# Altium project PRJ - LV Distribution & SD Latch.PrjPCB
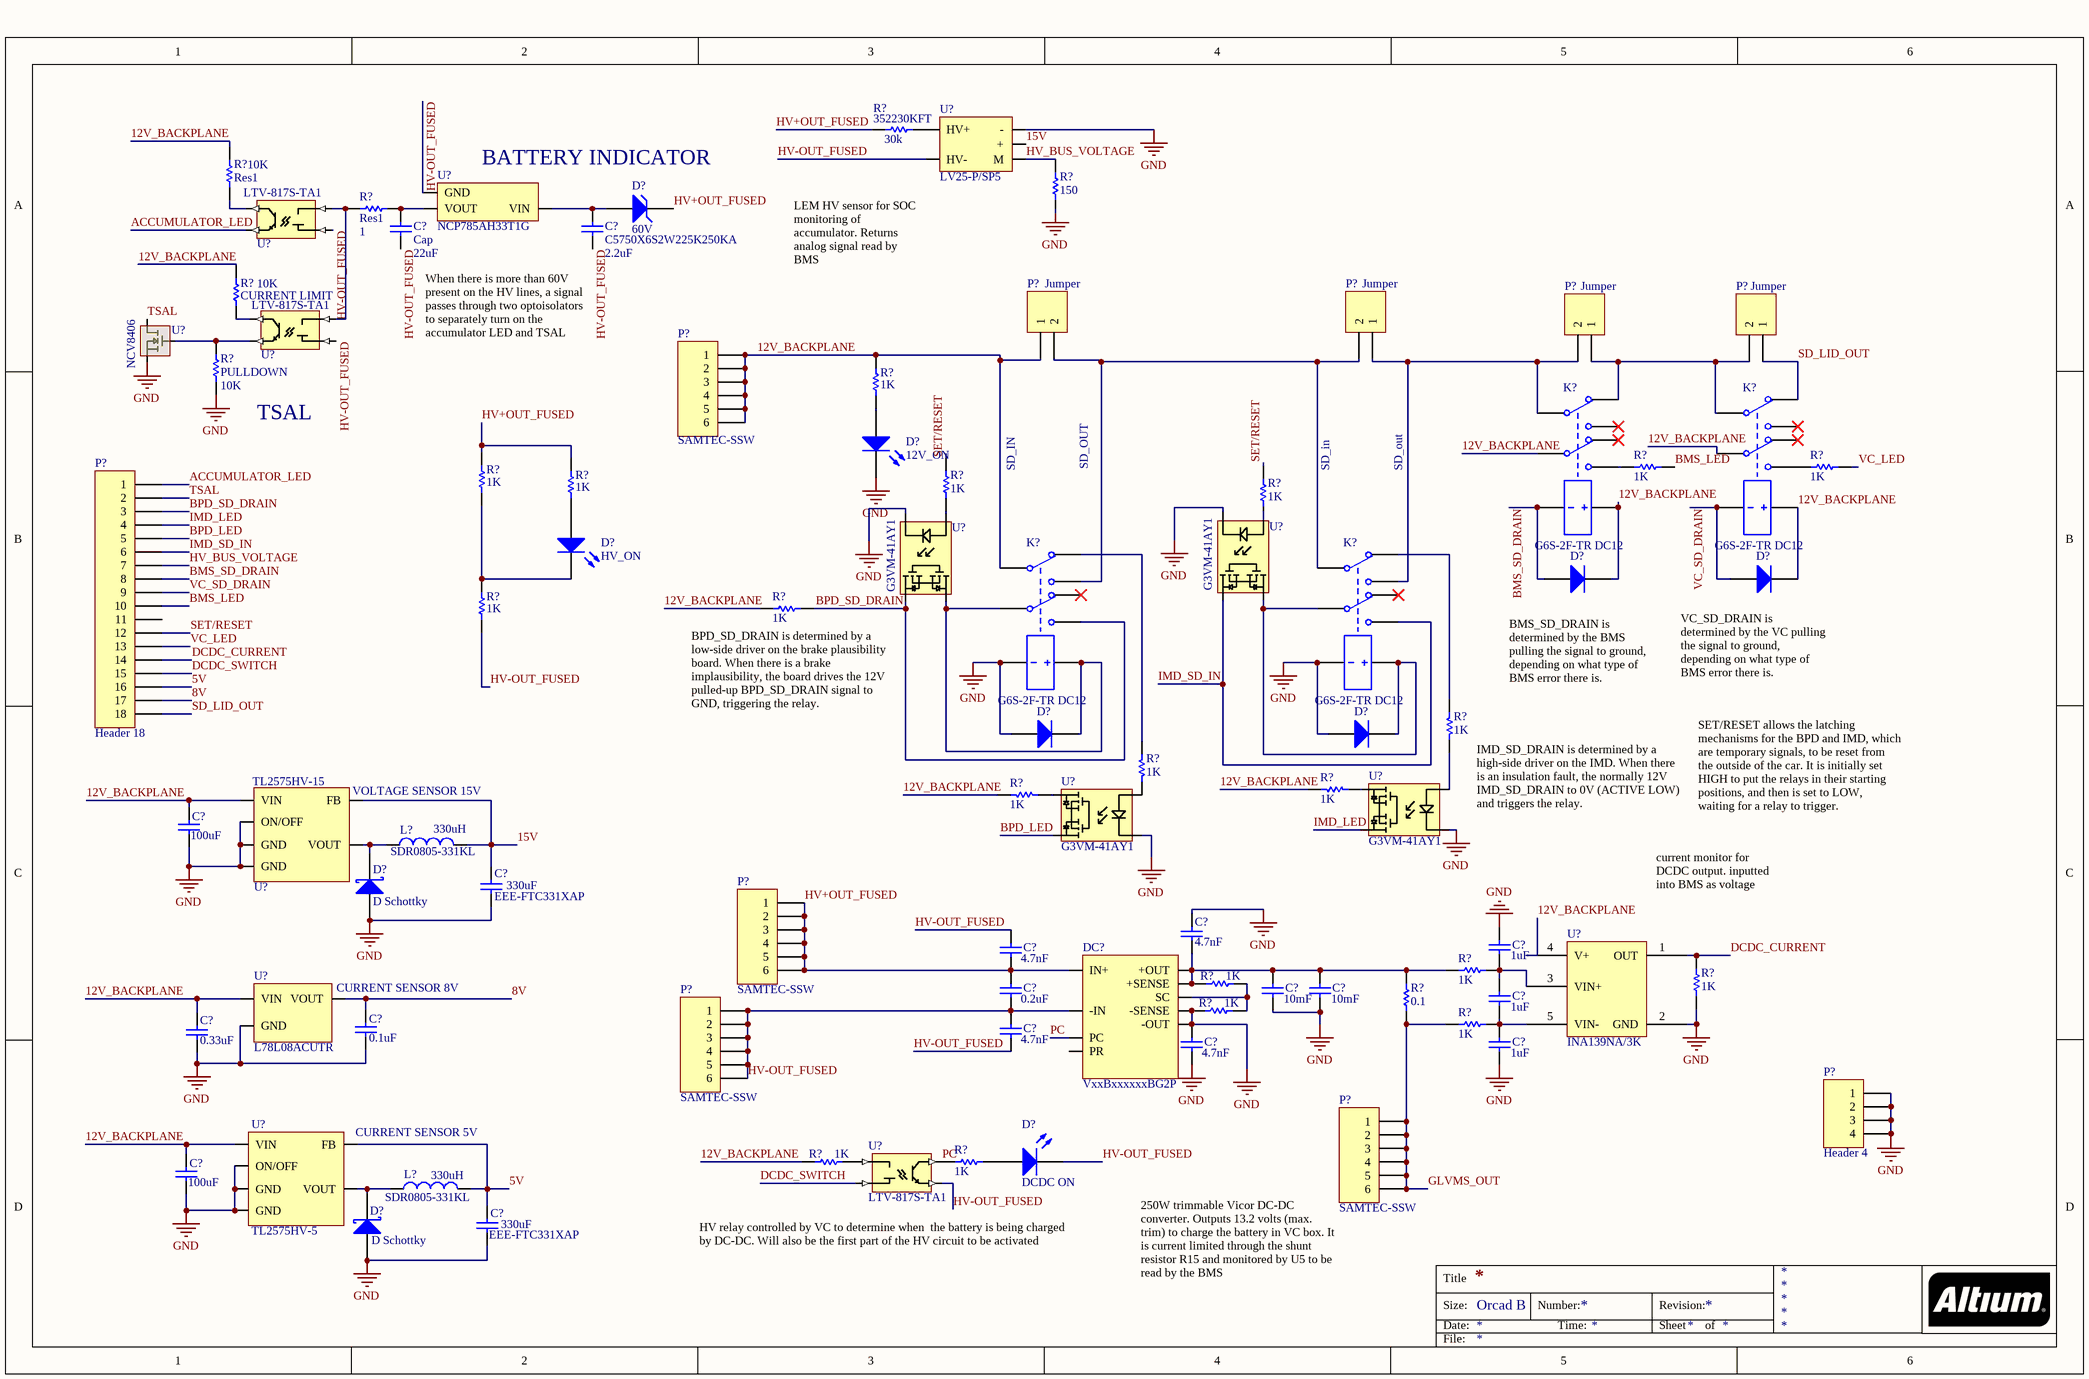
[diagram p0: LV Distribution & SD Latch.SchDoc]
1 sheet, 86 parts. Net scope: global (net labels, ports and power ports of the same name join across sheets).

## Sheet LV Distribution & SD Latch.SchDoc
size OrCAD B

### Parts
(Parts that share a designator on the sheet are numbered #1, #2 ... from top to bottom, then left to right.)
C?#1  Cap  value 22uF  [C0805]
C?#2  C5750X6S2W225K250KA  value 2.2uF  [CAPC5750L]
C?#3  value 100uF  [C1206]  (hidden comment: Cap)
C?#4  EEE-FTC331XAP  value 330uF  [EEE-FTC331XAP]
C?#5  value 4.7nF  [C0805]  (hidden comment: Cap)
C?#6  value 4.7nF  [C1206]  (hidden comment: Cap)
C?#7  value 1uF  [C0805]  (hidden comment: Cap)
C?#8  value 0.2uF  [14-1210]  (hidden comment: Cap)
C?#9  value 10mF  [RB7.6-15]  (hidden comment: Cap)
C?#10  value 10mF  [RB7.6-15]  (hidden comment: Cap)
C?#11  value 1uF  [C0805]  (hidden comment: Cap)
C?#12  value 0.33uF  [C0805]  (hidden comment: Cap)
C?#13  value 0.1uF  [C0805]  (hidden comment: Cap)
C?#14  value 4.7nF  [C1206]  (hidden comment: Cap)
C?#15  value 4.7nF  [C0805]  (hidden comment: Cap)
C?#16  value 1uF  [C0805]  (hidden comment: Cap)
C?#17  value 100uF  [C1206]  (hidden comment: Cap)
C?#18  EEE-FTC331XAP  value 330uF  [EEE-FTC331XAP]
D?#1  60V  [SMB]
D?#2  12V_ON  [3.2X1.6X1.1]
D?#3  HV_ON  [3.2X1.6X1.1]
D?#4  Diode 1N4002  [3.2X1.6X1.1]  (value not drawn)
D?#5  Diode 1N4002  [3.2X1.6X1.1]  (value not drawn)
D?#6  Diode 1N4002  [3.2X1.6X1.1]  (value not drawn)
D?#7  Diode 1N4002  [3.2X1.6X1.1]  (value not drawn)
D?#8  D Schottky  [SMB]
D?#9  DCDC ON  [3.2X1.6X1.1]
D?#10  D Schottky  [SMB]
DC?  VxxBxxxxxxBG2P  [VICOR_MINI]
K?#1  G6S-2F-TR DC12  [G6S-2F-TR DC12]
K?#2  G6S-2F-TR DC12  [G6S-2F-TR DC12]
K?#3  G6S-2F-TR DC12  [G6S-2F-TR DC12]
K?#4  G6S-2F-TR DC12  [G6S-2F-TR DC12]
L?#1  SDR0805-331KL  value 330uH  [SDR0805-331KL]
L?#2  SDR0805-331KL  value 330uH  [SDR0805-331KL]
P?#1  Jumper  [HDR1X2]
P?#2  Jumper  [HDR1X2]
P?#3  Jumper  [HDR1X2]
P?#4  Jumper  [HDR1X2]
P?#5  SAMTEC-SSW  [HDR2X3_CEN]
P?#6  Header 18  [HDR2X9]
P?#7  SAMTEC-SSW  [HDR2X3_CEN]
P?#8  SAMTEC-SSW  [HDR2X3_CEN]
P?#9  Header 4  [HDR2X2]
P?#10  SAMTEC-SSW  [HDR2X3_CEN]
R?#1  352230KFT  value 30k  [C2512]
R?#2  value 150  [RESC3216L]  (hidden comment: Res1)
R?#3  Res1  value 10K  [6-0805_L]
R?#4  Res1  value 1  [6-0805_L]
R?#5  CURRENT LIMIT  value 10K  [6-0805_L]
R?#6  PULLDOWN  value 10K  [6-0805_L]
R?#7  value 1K  [6-0805_N]  (hidden comment: Res1)
R?#8  value 1K  [6-0805_N]  (hidden comment: Res1)
R?#9  value 1K  [6-0805_N]  (hidden comment: Res1)
R?#10  value 1K  [6-0805_N]  (hidden comment: Res1)
R?#11  value 1K  [6-0805_N]  (hidden comment: Res1)
R?#12  value 1K  [6-0805_N]  (hidden comment: Res1)
R?#13  value 1K  [6-0805_N]  (hidden comment: Res1)
R?#14  value 1K  [6-0805_N]  (hidden comment: Res1)
R?#15  value 1K  [6-0805_N]  (hidden comment: Res1)
R?#16  value 1K  [6-0805_N]  (hidden comment: Res1)
R?#17  value 1K  [6-0805_N]  (hidden comment: Res1)
R?#18  value 1K  [6-0805_N]  (hidden comment: Res1)
R?#19  value 1K  [6-0805_N]  (hidden comment: Res1)
R?#20  value 1K  [6-0805_N]  (hidden comment: Res1)
R?#21  value 1K  [6-0805_N]  (hidden comment: Res1)
R?#22  value 1K  [6-0805_N]  (hidden comment: Res1)
R?#23  value 1K  [6-0805_N]  (hidden comment: Res1)
R?#24  value 0.1  [2818]
R?#25  value 1K  [6-0805_N]  (hidden comment: Res1)
R?#26  value 1K  [6-0805_N]  (hidden comment: Res1)
R?#27  value 1K  [6-0805_N]  (hidden comment: Res1)
U?#1  LV25-P/SP5  [LV 25-P/SP5]
U?#2  NCP785AH33T1G  [SOT89L]
U?#3  LTV-817S-TA1  [4-PIN SMD]
U?#4  LTV-817S-TA1  [4-PIN SMD]
U?#5  NCV8406  [SOT223-4M]
U?#6  G3VM-41AY1  [4-PIN SMD]
U?#7  G3VM-41AY1  [4-PIN SMD]
U?#8  G3VM-41AY1  [4-PIN SMD]
U?#9  G3VM-41AY1  [4-PIN SMD]
U?#10  TL2575HV-15  [TO170P1520-6N]
U?#11  INA139NA/3K  [SOT23-5AM]
U?#12  L78L08ACUTR  [SOT89]
U?#13  LTV-817S-TA1  [4-PIN SMD]
U?#14  TL2575HV-5  [TO170P1520-6N]

### Nets
GND: C?#3.1 C?#4.1 C?#5.2 C?#7.2 C?#9.1 C?#10.1 C?#12.1 C?#13.1 C?#15.1 C?#15.2 C?#16.1 C?#17.1 C?#18.1 D?#2.2(K) D?#6.1(A) D?#7.1(A) D?#8.1(A) D?#10.1(A) DC?.5(-OUT) DC?.6(-SENSE) K?#3.12 K?#4.12 P?#9.1 P?#9.2 P?#9.3 P?#9.4 R?#2.2 R?#6.1 R?#22.2 R?#23.1 U?#1.3(-) U?#5.3(SOURCE) U?#6.2 U?#7.2 U?#8.2 U?#9.2 U?#10.3(GND) U?#10.5(ON/OFF) U?#10.6(GND) U?#11.2(GND) U?#12.2(GND) U?#14.3(GND) U?#14.5(ON/OFF) U?#14.6(GND)
5V: C?#18.2 L?#2.2 P?#6.16 U?#14.4(FB)
8V: C?#13.2 P?#6.17 U?#12.1(VOUT)
12V_BACKPLANE: C?#3.2 C?#12.2 C?#17.2 D?#4.2(K) D?#5.2(K) K?#1.1 K?#1.9 K?#2.1 K?#2.9 K?#3.4 P?#1.1 P?#5.1 P?#5.2 P?#5.3 P?#5.4 P?#5.5 P?#5.6 R?#3.2 R?#5.2 R?#7.2 R?#14.1 R?#18.2 R?#19.2 R?#26.1 U?#10.1(VIN) U?#11.4(V+) U?#12.3(VIN) U?#14.1(VIN)
15V: C?#4.2 L?#1.2 U?#1.4(+) U?#10.4(FB)
ACCUMULATOR_LED: P?#6.1 U?#3.3
BMS_LED: P?#6.10 R?#8.2
BMS_SD_DRAIN: D?#4.1(A) K?#1.12 P?#6.8
BPD_LED: P?#6.5 U?#9.3
BPD_SD_DRAIN: K?#3.8 P?#6.3 R?#14.2 U?#6.3
DCDC_CURRENT: P?#6.14 R?#22.1 U?#11.1(OUT)
DCDC_SWITCH: P?#6.15 U?#13.2(OPTO1_OUT)
GLVMS_OUT: P?#10.1 P?#10.2 P?#10.3 P?#10.4 P?#10.5 P?#10.6 R?#24.1 R?#25.1
HV+OUT_FUSED: C?#6.1 C?#8.2 D?#1.2(K) DC?.1(IN+) P?#7.1 P?#7.2 P?#7.3 P?#7.4 P?#7.5 P?#7.6 R?#1.1 R?#12.2 R?#13.2
HV-OUT_FUSED: C?#1.1 C?#2.1 C?#6.2 C?#8.1 C?#14.1 C?#14.2 D?#9.2(K) DC?.4(-IN) P?#8.1 P?#8.2 P?#8.3 P?#8.4 P?#8.5 P?#8.6 R?#15.1 U?#1.2(HV-) U?#2.2(GND) U?#3.2(OPTO1_OUT) U?#4.2(OPTO1_OUT) U?#13.3
HV_BUS_VOLTAGE: P?#6.7 R?#2.1 U?#1.5(M)
IMD_LED: P?#6.4 U?#8.3
IMD_SD_IN: K?#4.8 P?#6.6 U?#7.3
PC: DC?.2(PC) R?#27.1 U?#13.4(OPTO1_C)
SD_LID_OUT: K?#2.3 P?#4.1 P?#6.18
SET/RESET: P?#6.12 R?#9.1 R?#10.1
TSAL: P?#6.2 U?#5.4(DRAIN)
VC_LED: P?#6.13 R?#11.1
VC_SD_DRAIN: D?#5.1(A) K?#2.12 P?#6.9
NetC?#1_2: C?#1.2 R?#4.2 U?#2.3(VOUT)
NetC?#2_2: C?#2.2 D?#1.1(A) U?#2.1(VIN)
NetC?#5_1: C?#5.1 C?#9.2 C?#10.2 DC?.8(+SENSE) DC?.9(+OUT) R?#20.1 R?#21.1 R?#24.2
NetC?#7_1: C?#7.1 C?#11.2 R?#20.2 U?#11.3(VIN+)
NetC?#11_1: C?#11.1 C?#16.2 R?#25.2 U?#11.5(VIN-)
NetD?#2_1: D?#2.1(A) R?#7.1
NetD?#3_1: D?#3.1(A) R?#13.1
NetD?#3_2: D?#3.2(K) R?#12.1 R?#15.2
NetD?#6_2: D?#6.2(K) K?#3.1 K?#3.9 U?#6.4
NetD?#7_2: D?#7.2(K) K?#4.1 K?#4.9 U?#7.4
NetD?#8_2: D?#8.2(K) L?#1.1 U?#10.2(VOUT)
NetD?#9_1: D?#9.1(A) R?#27.2
NetD?#10_2: D?#10.2(K) L?#2.1 U?#14.2(VOUT)
NetDC?_7: DC?.7(SC) R?#21.2 R?#23.2
NetK?#1_3: K?#1.3 K?#2.4 P?#3.1 P?#4.2
NetK?#1_4: K?#1.4 K?#4.5 P?#2.1 P?#3.2
NetK?#1_8: K?#1.8 R?#8.1
NetK?#2_8: K?#2.8 R?#11.2
NetK?#3_3: K?#3.3 R?#17.1
NetK?#3_5: K?#3.5 K?#4.4 P?#1.2 P?#2.2
NetK?#4_3: K?#4.3 R?#16.1
NetR?#1_2: R?#1.2 U?#1.1(HV+)
NetR?#3_1: R?#3.1 U?#3.4(OPTO1_C)
NetR?#4_1: R?#4.1 U?#3.1(OPTO1_IN) U?#4.1(OPTO1_IN)
NetR?#5_1: R?#5.1 U?#4.4(OPTO1_C)
NetR?#6_2: R?#6.2 U?#4.3 U?#5.1(GATE)
NetR?#9_2: R?#9.2 U?#6.1
NetR?#10_2: R?#10.2 U?#7.1
NetR?#16_2: R?#16.2 U?#8.1
NetR?#17_2: R?#17.2 U?#9.1
NetR?#18_1: R?#18.1 U?#8.4
NetR?#19_1: R?#19.1 U?#9.4
NetR?#26_2: R?#26.2 U?#13.1(OPTO1_IN)

Not connected (* = marked no-connect by the designer): DC? 3(PR); K?#1 5* 10*; K?#2 5* 10*; K?#3 10*; K?#4 10*; P?#6 11

### Notes on the sheet
- (near U?#2) BATTERY INDICATOR
- (near U?#1) LEM HV sensor for SOC monitoring of accumulator. Returns analog signal read by BMS
- (near C?#2) When there is more than 60V present on the HV lines, a signal passes through two optoisolators to separately turn on the accumulator LED and TSAL
- TSAL
- SD_IN
- SD_OUT
- SD_in
- SD_out
- (near R?#14) BPD_SD_DRAIN is determined by a low-side driver on the brake plausibility board. When there is a brake implausibility, the board drives the 12V pulled-up BPD_SD_DRAIN signal to GND, triggering the relay.
- (near D?#4) BMS_SD_DRAIN is determined by the BMS pulling the signal to ground, depending on what type of BMS error there is.
- (near D?#5) VC_SD_DRAIN is determined by the VC pulling the signal to ground, depending on what type of BMS error there is.
- (near U?#10) VOLTAGE SENSOR 15V
- IMD_SD_DRAIN is determined by a high-side driver on the IMD. When there is an insulation fault, the normally 12V IMD_SD_DRAIN to 0V (ACTIVE LOW) and triggers the relay.
- SET/RESET allows the latching mechanisms for the BPD and IMD, which are temporary signals, to be reset from the outside of the car. It is initially set HIGH to put the relays in their starting positions, and then is set to LOW, waiting for a relay to trigger.
- current monitor for DCDC output. inputted into BMS as voltage
- (near U?#12) CURRENT SENSOR 8V
- (near U?#14) CURRENT SENSOR 5V
- HV relay controlled by VC to determine when  the battery is being charged by DC-DC. Will also be the first part of the HV circuit to be activated
- (near P?#10) 250W trimmable Vicor DC-DC converter. Outputs 13.2 volts (max. trim) to charge the battery in VC box. It is current limited through the shunt resistor R15 and monitored by U5 to be read by the BMS
- Title
- Size:
- Date:
- Orcad B
- Number:
- Time:
- Revision:
- Sheet
- of
- File:

### Library data of the parts
C?#1-C?#3 C?#5-C?#8 C?#10-C?#17 = Cap: Capacitor; Published: 8-Jun-2000; LatestRevisionDate: 17-Jul-2002; LatestRevisionNote: Re-released for DXP Platform.; PackageReference: RAD-0.3; Publisher: Altium Limited; PackageDescription: Radial Cap, Thru-Hole; 2 Leads; 0.3 in Pin Spacing
C?#4 C?#18 = Cap: Published: 8-Jun-2000; LatestRevisionDate: 17-Jul-2002; LatestRevisionNote: Re-released for DXP Platform.; PackageReference: RAD-0.3; Publisher: Altium Limited; PackageDescription: Radial Cap, Thru-Hole; 2 Leads; 0.3 in Pin Spacing
C?#9 = Cap: UVR1C103MHD; Published: 8-Jun-2000; LatestRevisionDate: 17-Jul-2002; LatestRevisionNote: Re-released for DXP Platform.; PackageReference: RAD-0.3; Publisher: Altium Limited; PackageDescription: Radial Cap, Thru-Hole; 2 Leads; 0.3 in Pin Spacing
D?#1 = D Zener: Zener Diode; Published: 8-Jun-2000; LatestRevisionDate: 17-Jul-2002; LatestRevisionNote: Re-released for DXP Platform.; PackageReference: DIODE-0.7; Publisher: Altium Limited; PackageDescription: Diode, Thru-Hole; 2 Leads; 0.7 in Pin Spacing
D?#2 D?#3 D?#9 = LED2: Typical RED, GREEN, YELLOW, AMBER GaAs LED; Published: 8-Jun-2000; LatestRevisionDate: 17-Jul-2002; LatestRevisionNote: Re-released for DXP Platform.; PackageVersion: Feb-2002; PackageReference: 3.2X1.6X1.1; Publisher: Altium Limited; PackageDescription: SM LED; 2 Flat Leads
D?#4-D?#7 = Diode 1N4002: 1 Amp General Purpose Rectifier; Published: 8-Jun-2000; LatestRevisionDate: 17-Jul-2002; LatestRevisionNote: Re-released for DXP Platform.; DatasheetVersion: 1998; PackageVersion: Aug-1999; PackageReference: DO-41; Publisher: Altium Limited; PackageDescription: Diode, Axial; Body 5.2 x 2.7 mm (LxDia. max), Lead Dia. 0.86 mm (max); Code_JEDEC: DO-204-AL; ComponentLink1Description: Manufacturer Link; ComponentLink1URL: http://www.fairchildsemi.com/; ComponentLink2Description: Datasheet; ComponentLink2URL: http://www.fairchildsemi.com/ds/1N%2F1N4001.pdf
D?#8 D?#10 = D Schottky: Schottky Diode; Published: 8-Jun-2000; LatestRevisionDate: 17-Jul-2002; LatestRevisionNote: Re-released for DXP Platform.; PackageReference: SMB; Publisher: Altium Limited; PackageDescription: DO-214-AA/SMB; 2 C-Bend Leads; Body 5.3 x 3.6 mm, inc. leads (LxW); Code_JEDEC: DO-214-AA
DC? = VxxBxxxxxxBG2P: Vicor 250W 12V DCDC MINI
K?#1-K?#4 = Relay-DPDT: Dual-Pole Dual-Throw Relay; Published: 24-Mar-1999; LatestRevisionDate: 17-Jul-2002; LatestRevisionNote: Re-released for DXP Platform.; PackageReference: DIP-P8; Publisher: Altium Limited; PackageDescription: Relay; 8 Leads
L?#1 L?#2 = Inductor: Code_IEC: 1005; Published: 8-Jun-2000; LatestRevisionDate: 29-May-2009; LatestRevisionNote: IPC-7351 Footprint Added.; PackageReference: 0402-A; Publisher: Altium Limited; PackageDescription: Chip Inductor; Code_JEITA: 0402
P?#1-P?#4 = Header 2: Header, 2-Pin; LatestRevisionDate: 17-Jul-2002; LatestRevisionNote: Re-released for DXP Platform.; Publisher: Altium Limited
P?#5 P?#7 P?#8 P?#10 = Header 6: Header, 6-Pin; LatestRevisionDate: 17-Jul-2002; LatestRevisionNote: Re-released for DXP Platform.; Publisher: Altium Limited
P?#6 = Header 18: Header, 18-Pin; LatestRevisionDate: 17-Jul-2002; LatestRevisionNote: Re-released for DXP Platform.; Publisher: Altium Limited
P?#9 = Header 4: Header, 4-Pin; LatestRevisionDate: 17-Jul-2002; LatestRevisionNote: Re-released for DXP Platform.; Publisher: Altium Limited
R?#1-R?#27 = Res1: Resistor; Published: 8-Jun-2000; LatestRevisionDate: 17-Jul-2002; LatestRevisionNote: Re-released for DXP Platform.; PackageReference: AXIAL-0.3; Publisher: Altium Limited; PackageDescription: Axial Device, Thru-Hole; 2 Leads; 0.3 in Pin Spacing
U?#1 = LV25-P/SP5: HV voltage transducer
U?#2 = NCP785AH33T1G: 300V to 3.3V linear regulator, 10mA
U?#3 U?#4 U?#13 = LTV-817S-TA1: HV to GLVS optoisolator
U?#5 = NCV8402: LOW SIDE DRIVER, 42V, 2.37A
U?#10 U?#14 = TL2575HV-05: 60Vin, fixed 5Vout, 1A switching regulator
U?#11 = INA139NA/3K: current monitor, used with 0.01 ohm shunt resistor
U?#12 = L78L08ACUTR: 8V, 100mA linear regulator